# Altium schematic sheet RowDriver.SCHDOC
size A4; DocumentNumber: 5; SheetNumber: 5; SheetTotal: 6
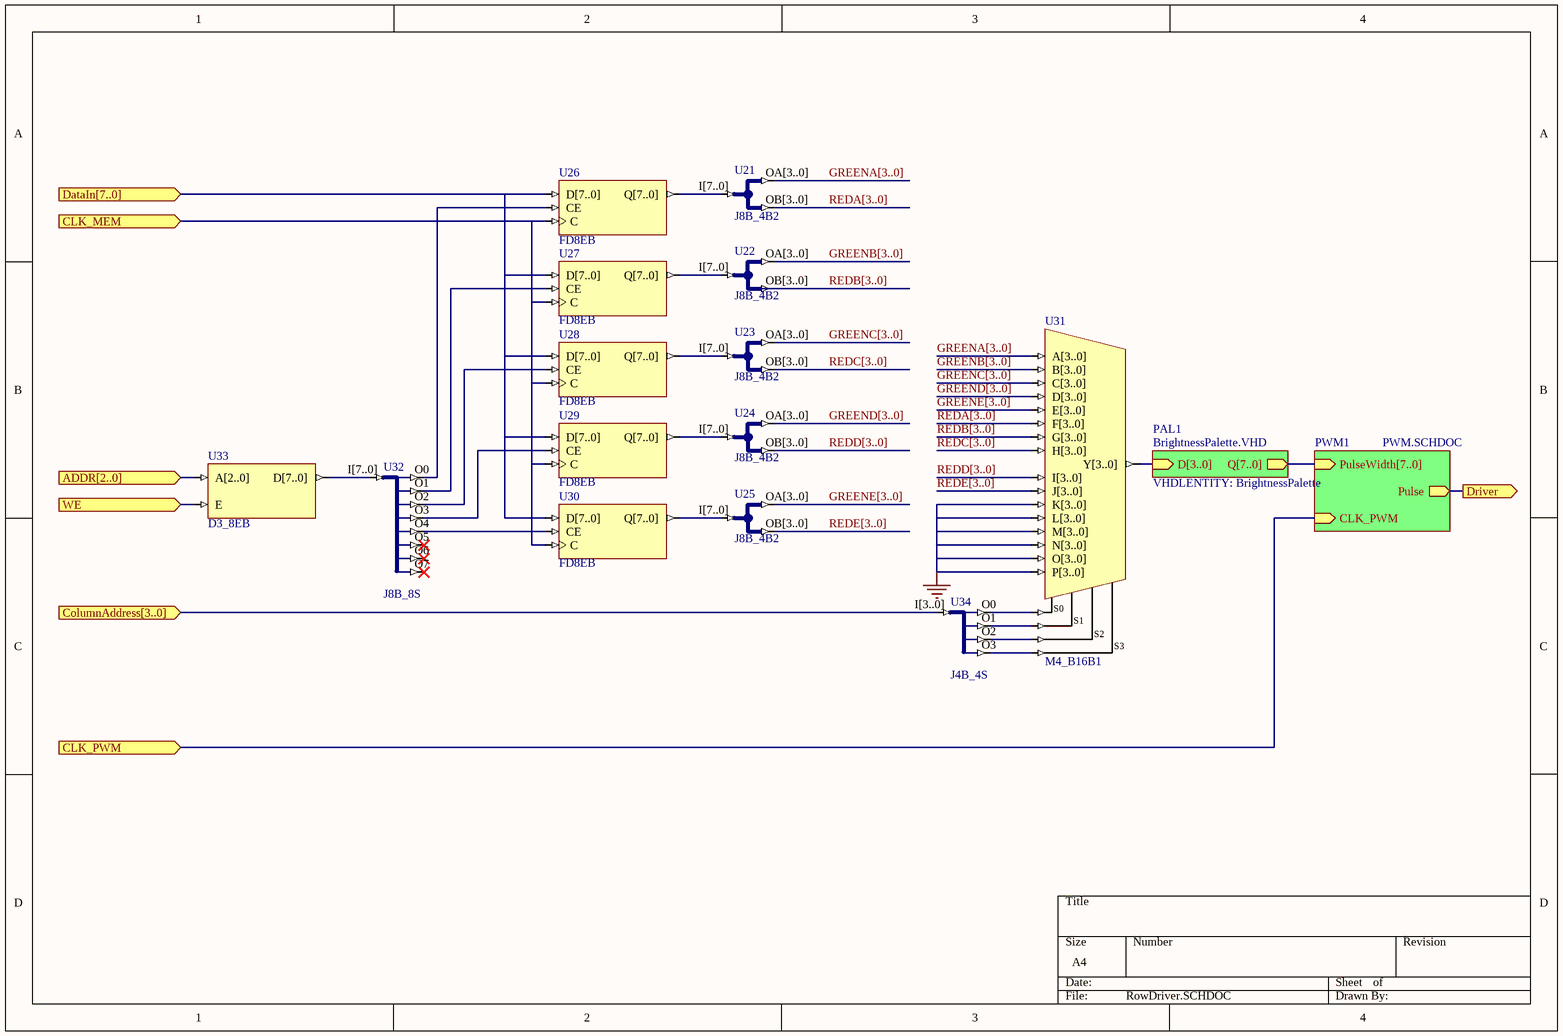
[diagram p0: RowDriver.SCHDOC]

## Parts
U21  J8B_4B2
U22  J8B_4B2
U23  J8B_4B2
U24  J8B_4B2
U25  J8B_4B2
U26  FD8EB
U27  FD8EB
U28  FD8EB
U29  FD8EB
U30  FD8EB
U31  M4_B16B1
U32  J8B_8S
U33  D3_8EB
U34  J4B_4S

## Sub-sheets
PAL1 = BrightnessPalette.VHD: D[3..0] (in), Q[7..0] (out)  | VHDLENTITY: BrightnessPalette
PWM1 = PWM.SCHDOC: Pulse (out), CLK_PWM (in), PulseWidth[7..0] (in)

## Ports
ADDR[2..0] (in), CLK_MEM (in), CLK_PWM (in), ColumnAddress[3..0] (in), DataIn[7..0] (in), Driver (out), WE (in)

## Nets
GNDBUS[..]: U31.K[3..0] U31.L[3..0] U31.M[3..0] U31.N[3..0] U31.O[3..0] U31.P[3..0]
ADDR[2..0]: U33.A[2..0] ; port ADDR[2..0]
CLK_MEM: U26.C U27.C U28.C U29.C U30.C ; port CLK_MEM
CLK_PWM: port CLK_PWM, sheet PWM1/CLK_PWM
ColumnAddress[3..0]: U34.I[3..0] ; port ColumnAddress[3..0]
DataIn[7..0]: U26.D[7..0] U27.D[7..0] U28.D[7..0] U29.D[7..0] U30.D[7..0] ; port DataIn[7..0]
Driver: port Driver, sheet PWM1/Pulse
GREENA[3..0]: U21.OA[3..0] U31.A[3..0]
GREENB[3..0]: U22.OA[3..0] U31.B[3..0]
GREENC[3..0]: U23.OA[3..0] U31.C[3..0]
GREEND[3..0]: U24.OA[3..0] U31.D[3..0]
GREENE[3..0]: U25.OA[3..0] U31.E[3..0]
REDA[3..0]: U21.OB[3..0] U31.F[3..0]
REDB[3..0]: U22.OB[3..0] U31.G[3..0]
REDC[3..0]: U23.OB[3..0] U31.H[3..0]
REDD[3..0]: U24.OB[3..0] U31.I[3..0]
REDE[3..0]: U25.OB[3..0] U31.J[3..0]
WE: U33.E ; port WE
NetU21_I[7..0]: U21.I[7..0] U26.Q[7..0]
NetU22_I[7..0]: U22.I[7..0] U27.Q[7..0]
NetU23_I[7..0]: U23.I[7..0] U28.Q[7..0]
NetU24_I[7..0]: U24.I[7..0] U29.Q[7..0]
NetU25_I[7..0]: U25.I[7..0] U30.Q[7..0]
NetU26_CE: U26.CE U32.O0
NetU27_CE: U27.CE U32.O1
NetU28_CE: U28.CE U32.O2
NetU29_CE: U29.CE U32.O3
NetU30_CE: U30.CE U32.O4
NetU31_S0: U31.S0 U34.O0
NetU31_S1: U31.S1 U34.O1
NetU31_S2: U31.S2 U34.O2
NetU31_S3: U31.S3 U34.O3
NetU31_Y[3..0]: U31.Y[3..0] ; sheet PAL1/D[3..0]
NetU32_I[7..0]: U32.I[7..0] U33.D[7..0]

Not connected (* = marked no-connect by the designer): U32 O5* O6* O7*

## Buses and harness runs
bus GREENA[3..0]
bus GREENB[3..0]
bus GREENC[3..0]
bus GREEND[3..0]
bus GREENE[3..0]
bus REDA[3..0]
bus REDB[3..0]
bus REDC[3..0]
bus REDD[3..0]
bus REDE[3..0]
bus sheet PAL1/Q[7..0] = sheet PWM1/PulseWidth[7..0]

## Library data of the parts
U21-U25 = J8B_4B2: 1 x 8-bit input bus to 2 x 4-Bit output bus; ArchiveName: GENERIC; Published: 7-Nov-2003; Publisher: Altium Limited; Core Revision: 1.00.00
U26-U30 = FD8EB: 8-Bit D Flip-Flop with Clock Enable, Bus Version; ArchiveName: GENERIC; Published: 7-Nov-2003; Publisher: Altium Limited; Core Revision: 1.00.00
U31 = M4_B16B1: 16x4-Bit Bus to 1x4-Bit Bus Multiplexer; ArchiveName: GENERIC; Published: 7-Nov-2003; Publisher: Altium Limited; Core Revision: 1.00.00
U32 = J8B_8S: 8-Bit input bus to 8 single pin outputs; ArchiveName: GENERIC; Published: 18-Dec-2003; Publisher: Altium Limited; Core Revision: 1.00.00
U33 = D3_8EB: Binary 3- to 8-Bit Decoder with Enable, Bus Version; ArchiveName: GENERIC; Published: 7-Nov-2003; Publisher: Altium Limited; Core Revision: 1.00.00
U34 = J4B_4S: 4-Bit input bus to 4 Single pin outputs; ArchiveName: GENERIC; Published: 18-Dec-2003; Publisher: Altium Limited; Core Revision: 1.00.00